# EAGLE design M453X (EAGLE 4.11)
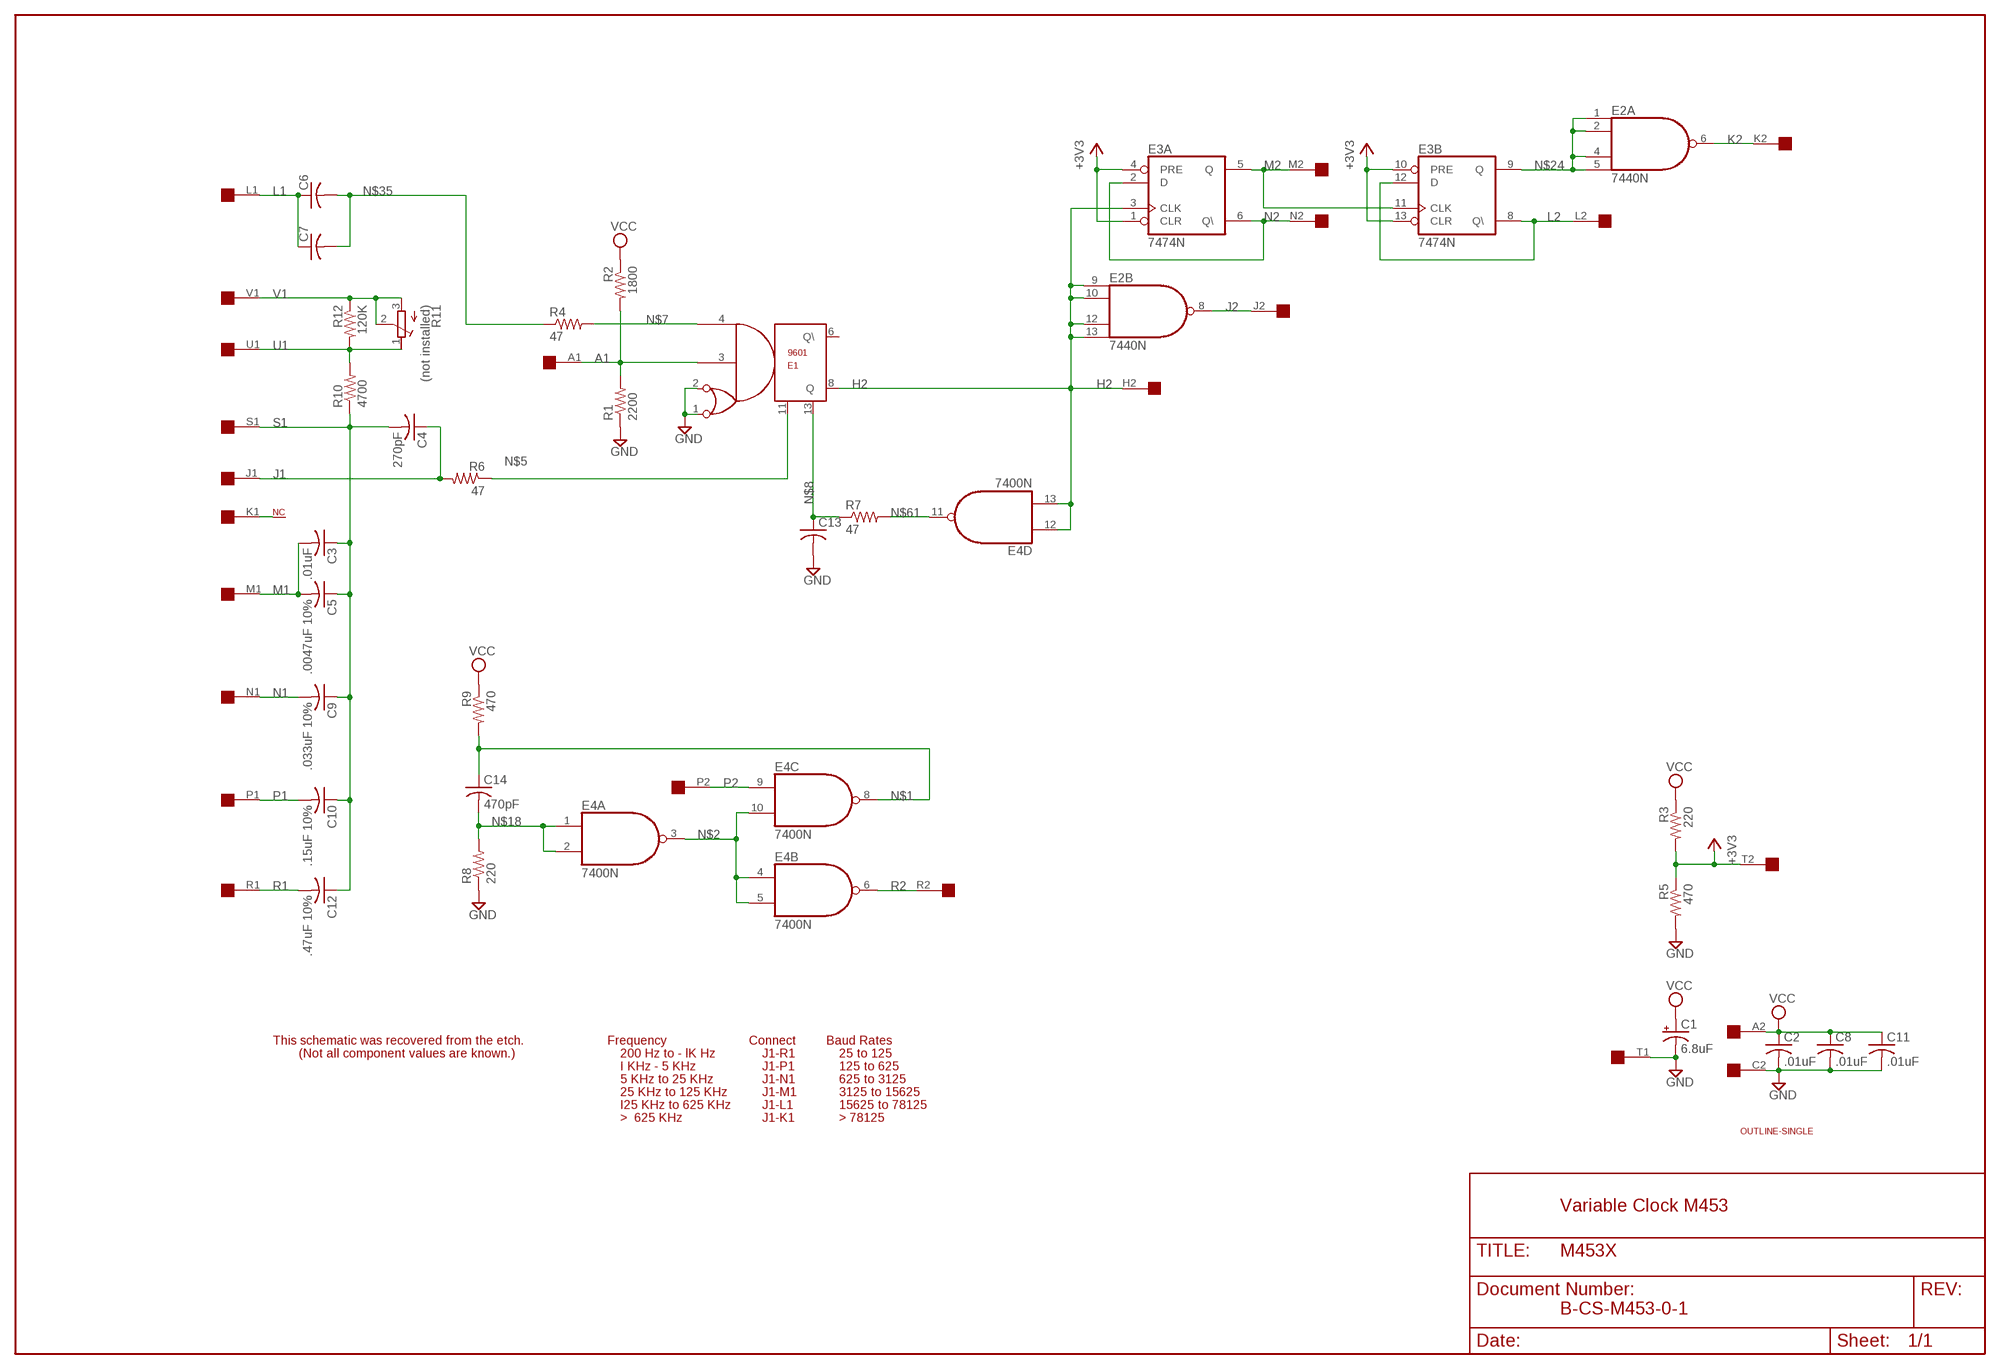
[diagram p0: schematic, sheet 1]

## Parts
C1  6.8uF  CPOL-USE20-8AXIAL  [E12-8]
C2  .01uF  C-US050-025X075  [C050-025X075]
C3  .01uF  C-US050-025X075  [C050-025X075]
C4  270pF  C-US050-025X075  [C050-025X075]
C5  .0047uF 10%  C-US225-062X268  [C225-062X268]
C6  C-US050-025X075  [C050-025X075]
C7  C-US050-025X075  [C050-025X075]
C8  .01uF  C-US050-025X075  [C050-025X075]
C9  .033uF 10%  C-US225-062X268  [C225-062X268]
C10  .15uF 10%  C-US325-137X374  [C325-137X374]
C11  .01uF  C-US050-025X075  [C050-025X075]
C12  .47uF 10%  C-US375-155X418  [C375-155X418]
C13  C-US050-025X075  [C050-025X075]
C14  470pF  C-US050-025X075  [C050-025X075]
E1  9601  [DIL14]
E2  7440N  74S20N  [DIL14]
E3  7474N  74S74N  [DIL14]
E4  7400N  [DIL14]
R1  2200  R-US_0207/10  [0207/10]
R2  1800  R-US_0207/10  [0207/10]
R3  220  R-US_0207/10  [0207/10]
R4  47  R-US_0207/10  [0207/10]
R5  470  R-US_0207/10  [0207/10]
R6  47  R-US_0207/10  [0207/10]
R7  47  R-US_0207/10  [0207/10]
R8  220  R-US_0207/10  [0207/10]
R9  470  R-US_0207/10  [0207/10]
R10  4700  R-US_0207/10  [0207/10]
R11  (not installed)  275P  [3006Y]
R12  120K  R-US_0207/10  [0207/10]
U$1  OUTLINE-SINGLE  [SINGLE]
U$3  SINGLE  [EDGE-CON2]

## Nets
+3V3: E3.1(A:CLR) E3.4(A:PRE) E3.10(B:PRE) E3.13(B:CLR) R3.2 R5.1 U$3.T2
A1: E1.3 R1.2 R2.2 U$3.A1
GND [power]: C1.- C2.2 C8.2 C11.2 C13.2 E1.1 E1.2 R1.1 R5.2 R8.1 U$3.C2 U$3.T1
H2: E1.8(Q) E2.9(B:I0) E2.10(B:I1) E2.12(B:I2) E2.13(B:I3) E3.3(A:CLK) E4.12(D:I0) E4.13(D:I1) U$3.H2
J1: C4.1 R6.2 U$3.J1
J2: E2.8(B:O) U$3.J2
K2: E2.6(A:O) U$3.K2
L1: C6.1 C7.1 U$3.L1
L2: E3.8(B:Q\) E3.12(B:D) U$3.L2
M1: C3.2 C5.2 U$3.M1
M2: E3.5(A:Q) E3.11(B:CLK) U$3.M2
N1: C9.2 U$3.N1
N2: E3.2(A:D) E3.6(A:Q\) U$3.N2
N$1: C14.1 E4.8(C:O) R9.2
N$2: E4.3(A:O) E4.4(B:I0) E4.5(B:I1) E4.10(C:I1)
N$5: E1.11 R6.1
N$7: E1.4 R4.2
N$8: C13.1 E1.13 R7.1
N$18: C14.2 E4.1(A:I0) E4.2(A:I1) R8.2
N$24: E2.1(A:I0) E2.2(A:I1) E2.4(A:I2) E2.5(A:I3) E3.9(B:Q)
N$35: C6.2 C7.2 R4.1
N$61: E4.11(D:O) R7.2
NC: U$3.K1
P1: C10.2 U$3.P1
P2: E4.9(C:I0) U$3.P2
R1: C12.2 U$3.R1
R2: E4.6(B:O) U$3.R2
S1: C3.1 C4.2 C5.1 C9.1 C10.1 C12.1 R10.1 U$3.S1
U1: R10.2 R11.1(A) R12.2 U$3.U1
V1: R11.2(S) R11.3(E) R12.1 U$3.V1
VCC [power]: C1.+ C2.1 C8.1 C11.1 R2.1 R3.1 R9.1 U$3.A2
Unconnected: E1.6(Q\) U$3.B1 U$3.B2 U$3.C1 U$3.D1 U$3.D2 U$3.E1 U$3.E2 U$3.F1 U$3.F2 U$3.H1 U$3.S2 U$3.U2 U$3.V2

## Notes on the sheet
- This schematic was recovered from the etch. | Frequency | Connect | Baud Rates
- (Not all component values are known.) | 200 Hz to - lK Hz | J1-R1 | 25 to 125
- I KHz - 5 KHz | J1-P1 | 125 to 625
- 5 KHz to 25 KHz | J1-N1 | 625 to 3125
- 25 KHz to 125 KHz | J1-M1 | 3125 to 15625
- I25 KHz to 625 KHz | J1-L1 | 15625 to 78125
- >  625 KHz | J1-K1 | > 78125
- Variable Clock M453
- B-CS-M453-0-1

## Power pins joined to a net without a drawn wire
GND: E1.7(GND) E2.7(P:GND) E3.7(P:GND) E4.7(P:GND)
VCC: E1.14(VCC) E2.14(P:VCC) E3.14(P:VCC) E4.14(P:VCC)

## Library data of the parts
C1 = dec-con:CPOL-USE20-8AXIAL: A 0.8 inch electrolytic.
C2-C14 = rcl:C-US: CAPACITOR, American symbol
E1 = dec-con:9601: DEC9601 monstable
E2 = 74xx-us:74*20: Dual 4-input NAND gate
E3 = 74xx-us:74*74: Dual D type positive edge triggered FLIP FLOP, preset and clear
E4 = 74xx-us:74*00: Quad 2-input NAND gate
R1-R10 R12 = rcl:R-US_: RESISTOR, American symbol
R11 = dec-con:275P: Trimpot with 275P (3006Y) footprint.
U$1 = dec-con:OUTLINE-*: Board outlines for DEC boards.
U$3 = dec-con:SINGLE: Single-Height DEC board

## Net classes
1 power: width 0.813 mm

## Board
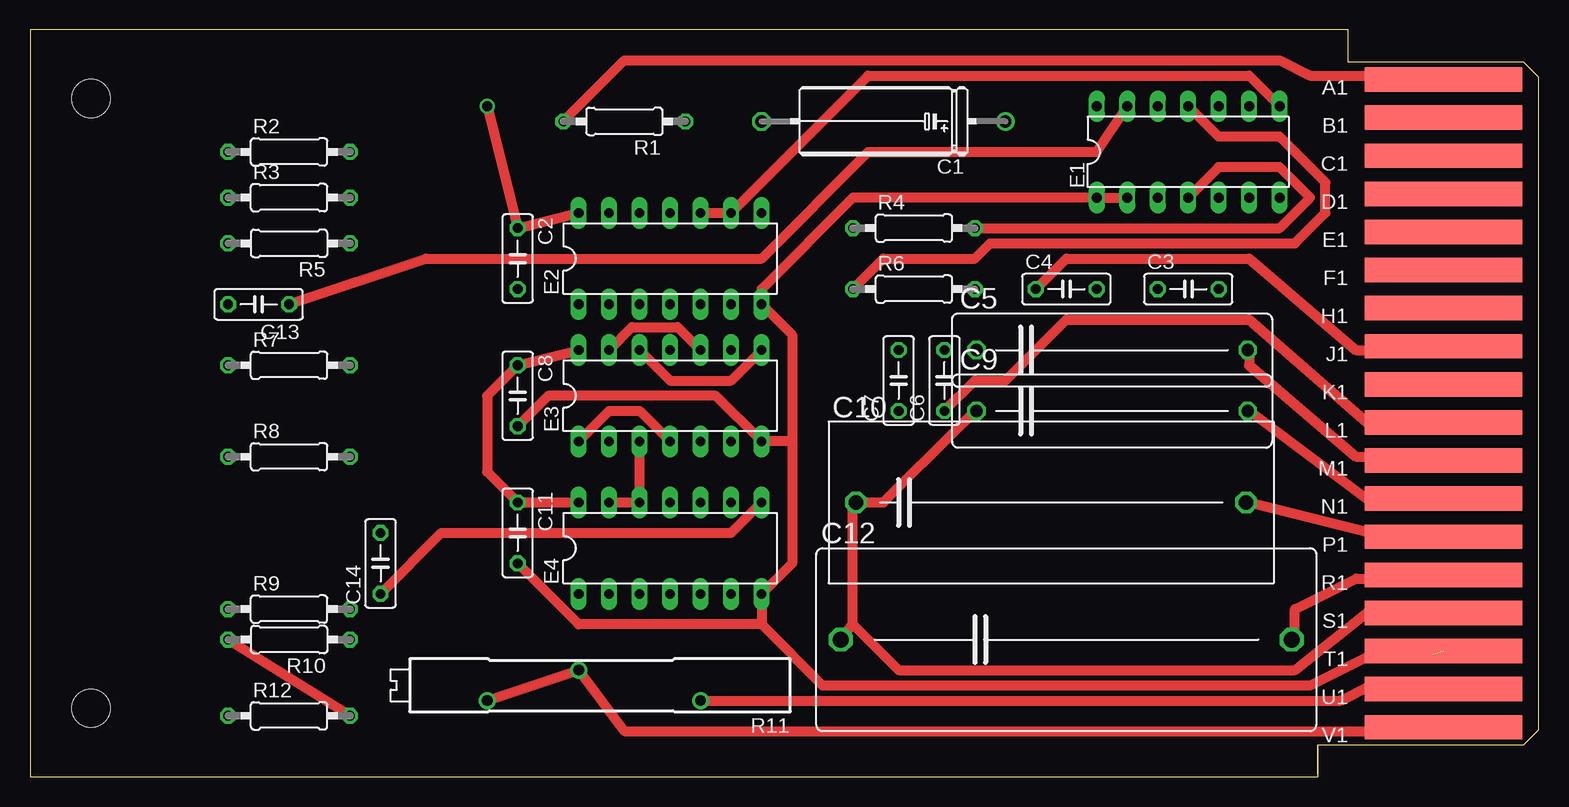
[diagram p1: board, top side]
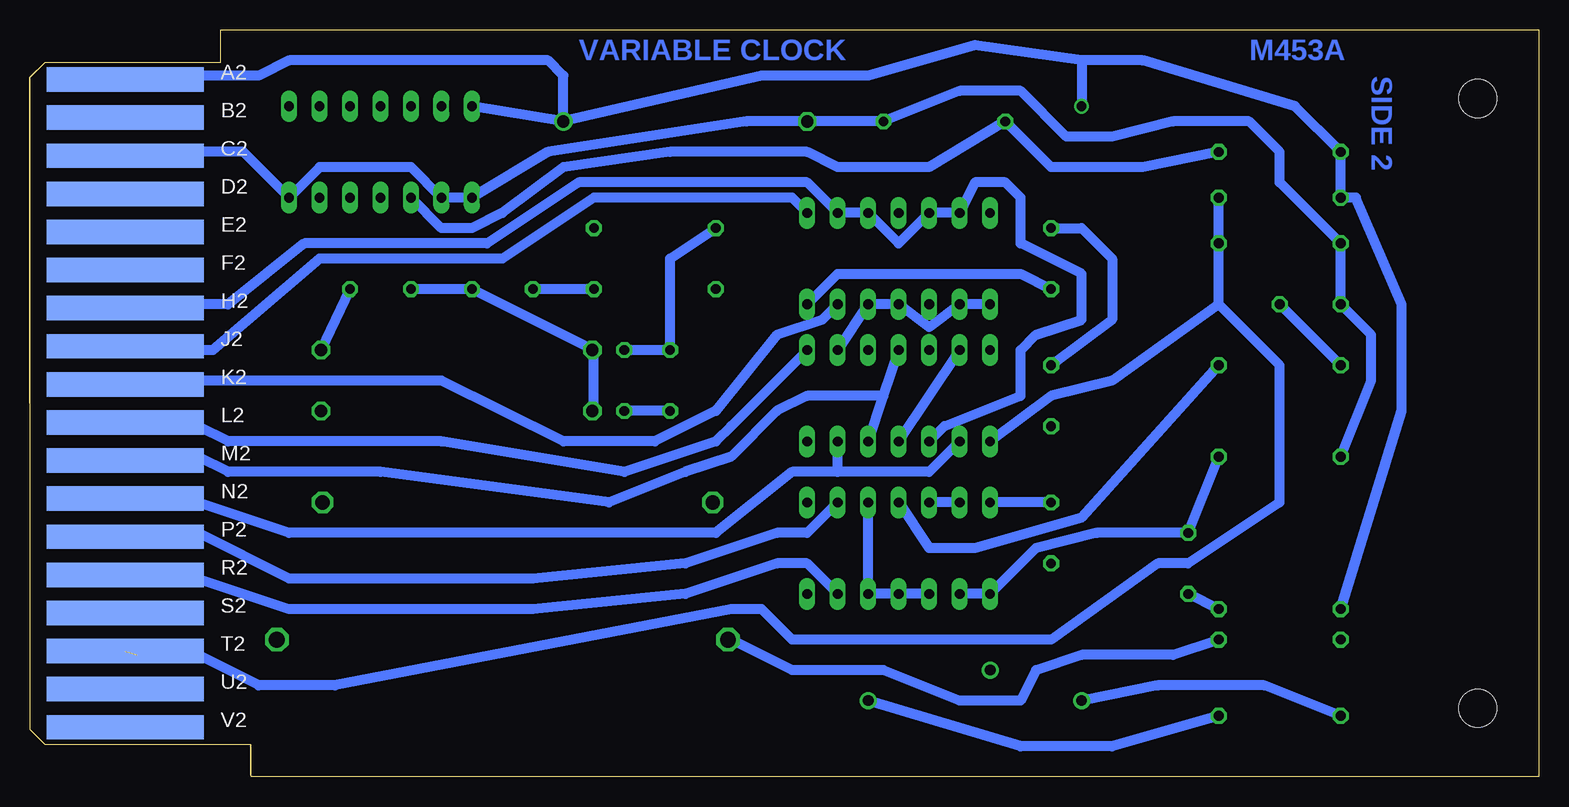
[diagram p2: board, bottom side, seen from below]

Size 125.73 x 62.23 mm. Coordinates in mm from the lower left corner, seen from the top.
Copper layers (1+16): Top 0.035mm / dielectric 1.5mm / Bottom 0.035mm
Design rules "16mils": minimum track width 16mil, minimum drill 32mil, track to track 15mil, track to pad 10mil, pad to pad 10mil, via to via 10mil, smd to smd 10mil, copper to edge 13mil, drill to drill 10mil, minimum pad ring 10mil, minimum via ring 8mil, stop-mask expansion 0mil, vias tented up to drill 0mil, thermal gap 10mil

### Footprints (pad centres in the part's own frame; a part is rotated, then mirrored left to right if it is on the bottom)
E12-8 = drill 1.016: + -10.16,0 | drill 1.016 octagon: - 10.16,0
C050-025X075 = drill 0.813 octagon: 1 -2.54,0; 2 2.54,0
C225-062X268 = drill 1.016 octagon: 1 -11.303,0; 2 11.303,0
C325-137X374 = drill 1.194 octagon: 1 -16.256,0; 2 16.256,0
C375-155X418 = drill 1.321 octagon: 1 -18.796,0; 2 18.796,0
DIL14 = drill 0.813 long: 1 -7.62,-3.81; 2 -5.08,-3.81; 3 -2.54,-3.81; 4 0,-3.81; 5 2.54,-3.81; 6 5.08,-3.81; 7 7.62,-3.81; 8 7.62,3.81; 9 5.08,3.81; 10 2.54,3.81; 11 0,3.81; 12 -2.54,3.81; 13 -5.08,3.81; 14 -7.62,3.81
0207/10 = drill 0.813 octagon: 1 -5.08,0; 2 5.08,0
3006Y = drill 0.9: 1 -8.89,1.27; 2 1.27,-1.27; 3 8.89,1.27
SINGLE = hole 3.175: 120.65,56.515; 120.65,5.715
EDGE-CON2 = smd 13.106 x 2.032: A1 7.938,4.128; B1 7.938,7.303; C1 7.938,10.477; D1 7.938,13.652; E1 7.938,16.828; F1 7.938,20.003; H1 7.938,23.177; J1 7.938,26.352; K1 7.938,29.527; L1 7.938,32.703; M1 7.938,35.877; N1 7.938,39.053; P1 7.938,42.227; R1 7.938,45.403; S1 7.938,48.578; T1 7.938,51.752; U1 7.938,54.928; V1 7.938,58.102 | smd 13.106 x 2.032 bottom: A2 7.938,4.128; B2 7.938,7.303; C2 7.938,10.477; D2 7.938,13.652; E2 7.938,16.828; F2 7.938,20.003; H2 7.938,23.177; J2 7.938,26.352; K2 7.938,29.527; L2 7.938,32.703; M2 7.938,35.877; N2 7.938,39.053; P2 7.938,42.227; R2 7.938,45.403; S2 7.938,48.578; T2 7.938,51.752; U2 7.938,54.928; V2 7.938,58.102

### Placement (x,y rotation side)
C1  71.12,54.61 180 top
C2  40.64,43.18 270 top
C3  96.52,40.64 0 top
C4  86.36,40.64 0 top
C5  90.17,35.56 0 top
C6  76.2,33.02 90 top
C7  72.39,33.02 90 top
C8  40.64,31.75 270 top
C9  90.17,30.48 0 top
C10  85.09,22.86 0 top
C11  40.64,20.32 270 top
C12  86.36,11.43 0 top
C13  19.05,39.37 180 top
C14  29.21,17.78 90 top
E1  96.52,52.07 0 top
E2  53.34,43.18 0 top
E3  53.34,31.75 0 top
E4  53.34,19.05 0 top
R1  49.53,54.61 180 top
R2  21.59,52.07 0 top
R3  21.59,48.26 0 top
R4  73.66,45.72 0 top
R5  21.59,44.45 180 top
R6  73.66,40.64 0 top
R7  21.59,34.29 0 top
R8  21.59,26.67 0 top
R9  21.59,13.97 0 top
R10  21.59,11.43 180 top
R11  46.99,7.62 180 top
R12  21.59,5.08 0 top
U$1  125.73,62.23 180 top
U$3  125.73,62.23 180 top

### Tracks (layer width: path | path; a pad name or v marks a point on that pad's centre or on a via)
+3V3  (1 unrouted)
  Top 0.813: E3.1 48.26,30.48 50.8,30.48 E3.4 | E3.13 50.16,37.47 53.98,37.47 E3.10
  Bottom 0.813: R3.2 R5.1 26.67,39.37 | 26.67,39.37 21.59,34.29 21.59,22.86 29.21,17.78 31.75,17.78 40.64,11.43 62.23,11.43 64.77,13.97 67.31,13.97 100.33,7.62 106.68,7.62 111.76,10.16 116.84,10.16 | 26.67,39.37 35.56,33.02 40.64,31.75 E3.1 | E3.4 E3.13
A1
  Top 0.813: U$3.A1 116.84,58.42 106.68,58.42 104.14,59.69 49.53,59.69 R1.2
  Bottom 0.813: R2.2 33.02,50.8 40.64,50.8 R1.2 50.8,50.8 58.42,50.8 60.96,52.07 72.39,52.07 81.28,50.8 86.36,46.99 88.9,45.72 91.44,45.72 E1.3
GND
  Top 0.813: C8.2 43.18,31.75 57.15,31.75 E3.7 63.5,27.94 | C11.2 45.72,12.7 60.96,12.7 | 63.5,27.94 63.5,17.78 E4.7 60.96,12.7 | 63.5,27.94 63.5,36.83 E2.7 60.96,40.64 68.58,48.26 E1.1 E1.2 | U$3.T1 116.84,10.16 111.76,10.16 106.68,7.62 66.04,7.62 60.96,12.7
  Bottom 0.813: U$3.C2 116.84,52.07 107.95,52.07 E1.7 101.6,50.8 93.98,50.8 E1.2 E1.1 82.55,52.07 66.04,54.61 C1.- R1.1 48.26,57.15 43.18,57.15 39.37,53.34 35.56,53.34 30.48,54.61 24.13,54.61 21.59,52.07 21.59,49.53 R5.2 C13.2 13.97,36.83 13.97,33.02 R8.1 | C2.2 43.18,41.91 58.42,41.91 E2.7
H2
  Top 0.813: E4.13 E4.12 E3.3 | E2.10 E2.9 69.85,58.42 101.6,58.42 E1.8
  Bottom 0.813: U$3.H2 116.84,39.37 109.22,39.37 102.87,44.45 87.63,44.45 80.01,49.53 60.96,49.53 E2.9 E2.10 53.34,44.45 E2.12 E2.13 46.99,49.53 44.45,49.53 43.18,48.26 43.18,44.45 38.1,41.91 38.1,38.1 41.91,36.83 43.18,35.56 43.18,31.75 49.53,29.21 E3.3 | E4.13 E4.12
J1
  Top 0.813: U$3.J1 116.84,35.56 110.49,35.56 101.6,43.18 86.36,43.18 C4.1
  Bottom 0.813: R6.2 C4.1
J2
  Bottom 0.813: E2.8 62.23,48.26 78.74,48.26 86.36,43.18 101.6,43.18 110.49,35.56 116.84,35.56 U$3.J2
K2
  Bottom 0.813: E2.6 59.69,38.1 63.5,36.83 68.58,30.48 73.66,27.94 81.28,27.94 91.44,33.02 116.84,33.02 U$3.K2
L1
  Top 0.813: U$3.L1 116.84,29.21 111.76,29.21 101.6,38.1 86.36,38.1 81.28,33.02 78.74,33.02 C6.1
  Bottom 0.813: C7.1 C6.1
L2
  Top 0.813: E3.12 53.34,33.02 58.42,33.02 E3.8
  Bottom 0.813: E3.8 67.31,29.21 68.58,27.94 76.2,25.4 91.44,27.94 109.22,27.94 111.76,29.21 116.84,29.21 U$3.L2
M1
  Top 0.813: U$3.M1 116.84,26.67 111.76,26.67 110.49,26.67 101.6,34.29 101.6,35.56 C5.2
  Bottom 0.813: C5.2 C3.2
M2
  Bottom 0.813: 54.61,31.75 E3.11 | E3.5 54.61,31.75 | 54.61,31.75 60.96,31.75 63.5,30.48 67.31,26.67 71.12,25.4 77.47,22.86 96.52,25.4 109.22,25.4 111.76,26.67 116.84,26.67 U$3.M2
N1
  Top 0.813: U$3.N1 116.84,22.86 111.76,22.86 101.6,30.48 C9.2
N2
  Bottom 0.813: E3.2 50.8,25.4 58.42,25.4 | 58.42,25.4 E3.6 | 58.42,25.4 62.23,25.4 68.58,20.32 104.14,20.32 111.76,22.86 116.84,22.86 U$3.N2
N$1
  Top 0.813: C14.1 34.29,20.32 58.42,20.32 E4.8
  Bottom 0.813: R9.2 C14.1
N$2
  Bottom 0.813: E4.10 E4.5 E4.4 E4.3
N$5
  Top 0.813: R6.1 71.12,43.18 78.74,43.18 80.01,44.45 105.41,44.45 107.95,46.99 107.95,49.53 104.14,53.34 99.06,53.34 E1.11
N$7
  Top 0.813: R4.2 104.14,45.72 106.68,48.26 104.14,50.8 99.06,50.8 E1.4
N$8
  Top 0.813: C13.1 33.02,43.18 60.96,43.18 69.85,52.07 88.9,52.07 E1.13
  Bottom 0.813: R7.1 C13.1
N$18
  Bottom 0.813: R8.2 C14.2 36.83,20.32 41.91,19.05 E4.1 E4.2
N$24
  Bottom 0.813: E2.1 E2.2 50.8,37.47 E2.4 E2.5 E3.9
N$35
  Bottom 0.813: C6.2 C7.2 72.39,43.18 R4.1
N$61
  Bottom 0.813: R7.2 38.1,21.59 46.99,19.05 50.8,19.05 E4.11
P1
  Top 0.813: U$3.P1 116.84,20.32 111.76,20.32 101.6,22.86 C10.2
P2
  Bottom 0.813: E4.9 60.96,20.32 63.5,20.32 71.12,17.78 83.82,16.51 104.14,16.51 111.76,20.32 116.84,20.32 U$3.P2
R1
  Top 0.813: U$3.R1 116.84,16.51 111.76,16.51 110.49,16.51 105.41,13.97 105.41,11.43 C12.2
R2
  Bottom 0.813: E4.6 60.96,17.78 63.5,17.78 71.12,15.24 83.82,13.97 104.14,13.97 111.76,16.51 116.84,16.51 U$3.R2
S1
  Top 0.813: C12.1 68.58,12.7 | 68.58,22.86 C10.1 | 68.58,12.7 68.58,22.86 | 68.58,22.86 71.12,22.86 77.47,29.21 C9.1 | U$3.S1 116.84,13.97 111.76,13.97 105.41,8.89 72.39,8.89 68.58,12.7
  Bottom 0.813: C3.1 C4.2 78.74,35.56 | 78.74,35.56 C5.1 | C9.1 78.74,30.48 78.74,35.56 | R10.1 30.48,10.16 38.1,10.16 41.91,8.89 43.18,6.35 48.26,6.35 54.61,8.89 62.23,8.89 67.31,11.43 C12.1
U1
  Top 0.813: R10.2 R12.2 | U$3.U1 116.84,7.62 111.76,7.62 109.22,6.35 R11.1
  Bottom 0.813: R12.2 35.56,2.54 43.18,2.54 R11.1
V1
  Top 0.813: R11.3 R11.2 49.53,3.81 116.84,3.81 U$3.V1
  Bottom 0.813: R11.3 31.75,7.62 22.86,7.62 R12.1
VCC  (via drill 0.81)
  Top 0.813: E4.14 C11.1 38.1,25.4 38.1,31.75 C8.1 E3.14 | E2.14 C2.1 v38.1,55.88
  Bottom 0.813: U$3.A2 116.84,58.42 106.68,58.42 104.14,59.69 82.55,59.69 81.28,58.42 C1.+ | C1.+ E1.14 | C1.+ 64.77,58.42 55.88,58.42 46.99,60.96 38.1,59.69 | 38.1,59.69 v38.1,55.88 | 38.1,59.69 33.02,59.69 20.32,55.88 R2.1 R3.1 15.24,48.26 11.43,39.37 11.43,30.48 R9.1 | C11.1 E4.14 | C2.1 38.1,45.72 35.56,43.18 35.56,38.1 C8.1

### Text on the board
Bottom: M453A | VARIABLE CLOCK | SIDE 2